# Altium schematic sheet RS232toUART.SchDoc: RS232 to UART Converter
size 431 x 279 mm; DocumentNumber: 12; SheetNumber: 12; SheetTotal: 18; ENG_APP_DATE: --/--/--; DSN_APP_DATE: --/--/--; CHK_APP_DATE: --/--/--
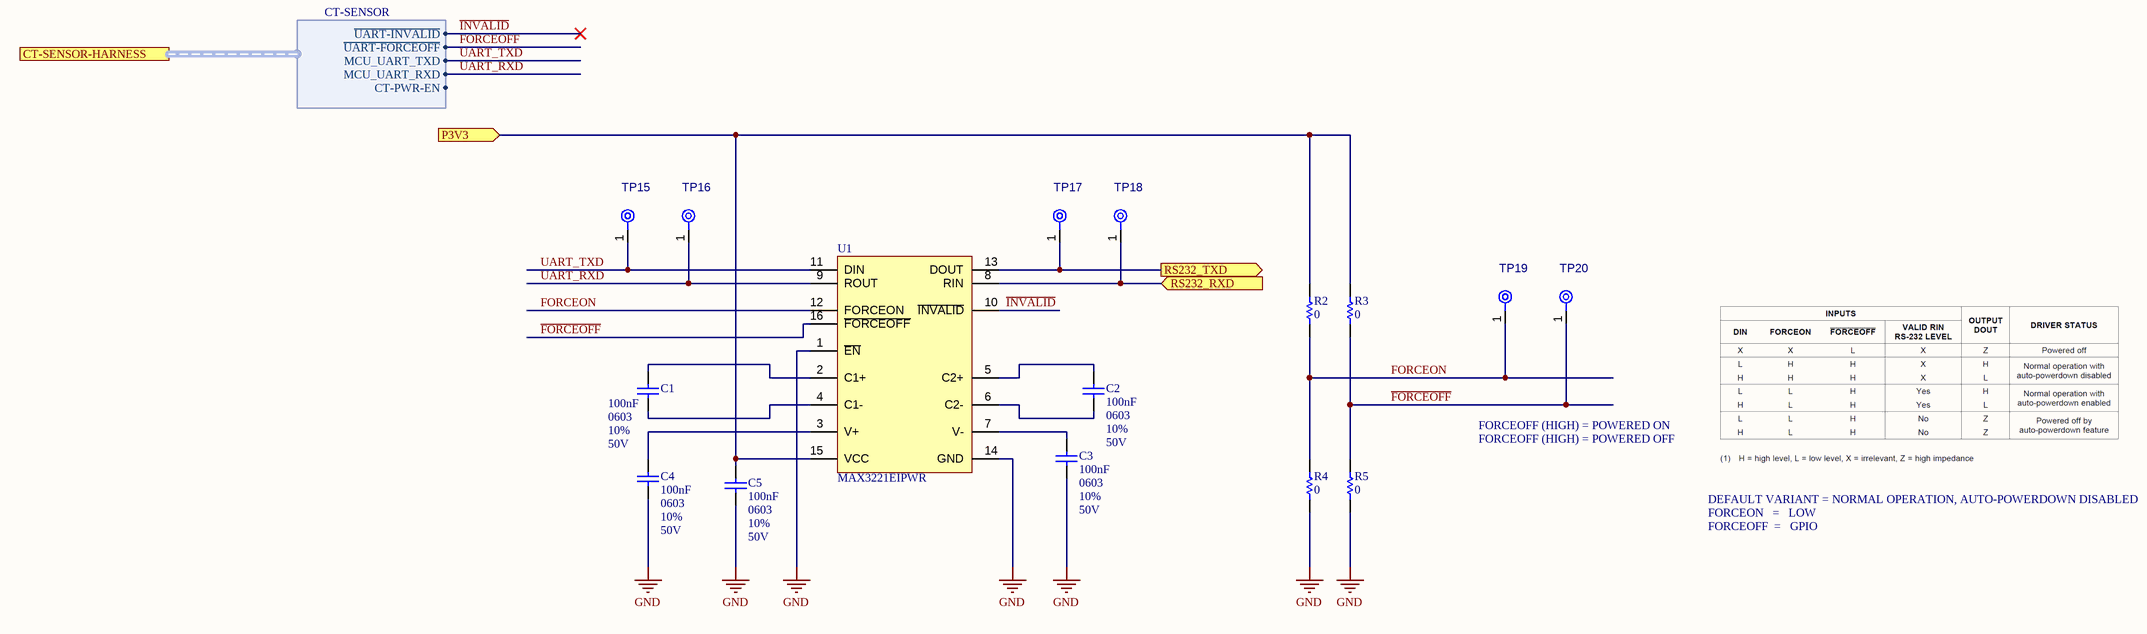
[diagram p0: RS232toUART.SchDoc]

## Parts
C1  value 100nF  Case/Package: 0603  Tolerance: 10%  Voltage Rating: 50V  [CAPC1608X90X40ML10T20]  (hidden comment: Capacitor 100nF +/- 10%, 50V, X7R, 0603)
C2  value 100nF  Case/Package: 0603  Tolerance: 10%  Voltage Rating: 50V  [CAPC1608X90X40ML10T20]  (hidden comment: Capacitor 100nF +/- 10%, 50V, X7R, 0603)
C3  value 100nF  Case/Package: 0603  Tolerance: 10%  Voltage Rating: 50V  [CAPC1608X90X40ML10T20]  (hidden comment: Capacitor 100nF +/- 10%, 50V, X7R, 0603)
C4  value 100nF  Case/Package: 0603  Tolerance: 10%  Voltage Rating: 50V  [CAPC1608X90X40ML10T20]  (hidden comment: Capacitor 100nF +/- 10%, 50V, X7R, 0603)
C5  value 100nF  Case/Package: 0603  Tolerance: 10%  Voltage Rating: 50V  [CAPC1608X90X40ML10T20]  (hidden comment: Capacitor 100nF +/- 10%, 50V, X7R, 0603)
R2  value 0  [RESC2013X50X35ML15T15]  (hidden comment: Resistor 0R +/- 1% 0805 125 mW)
R3  value 0  [RESC2013X50X35ML15T15]  (hidden comment: Resistor 0R +/- 1% 0805 125 mW)
R4  value 0  [RESC2013X50X35ML15T15]  (hidden comment: Resistor 0R +/- 1% 0805 125 mW)
R5  value 0  [RESC2013X50X35ML15T15]  (hidden comment: Resistor 0R +/- 1% 0805 125 mW)
TP15  TPAD6R-CIRCLED  [TP06R - Circled]  (value not drawn)  (no BOM)
TP16  TPAD6R-CIRCLED  [TP06R - Circled]  (value not drawn)  (no BOM)
TP17  TPAD6R-CIRCLED  [TP06R - Circled]  (value not drawn)  (no BOM)
TP18  TPAD6R-CIRCLED  [TP06R - Circled]  (value not drawn)  (no BOM)
TP19  TPAD6R-CIRCLED  [TP06R - Circled]  (value not drawn)  (no BOM)
TP20  TPAD6R-CIRCLED  [TP06R - Circled]  (value not drawn)  (no BOM)
U1  MAX3221EIPWR  [PW0016A_M]

## Ports
CT-SENSOR-HARNESS (harness CT-SENSOR), P3V3 (in), RS232_RXD (in), RS232_TXD (out)

## Harnesses
CT-SENSOR: MCU_UART_RXD, MCU_UART_TXD, ~{UART-FORCEOFF}, ~{UART-INVALID}, CT-PWR-EN

## Nets
GND: C3.1 C4.1 C5.1 R4.1 R5.1 U1.1(~{EN}) U1.14(GND)
~{FORCEOFF}: R3.1 R5.2 TP20.1(TP) U1.16(~{FORCEOFF}) ; port CT-SENSOR-HARNESS.~{UART-FORCEOFF}
~{INVALID}: U1.10(~{INVALID}) ; port CT-SENSOR-HARNESS.~{UART-INVALID}
FORCEON: R2.1 R4.2 TP19.1(TP) U1.12(FORCEON)
P3V3: C5.2 R2.2 R3.2 U1.15(VCC) ; port P3V3
RS232_RXD: TP18.1(TP) U1.8(RIN) ; port RS232_RXD
RS232_TXD: TP17.1(TP) U1.13(DOUT) ; port RS232_TXD
UART_RXD: TP16.1(TP) U1.9(ROUT) ; port CT-SENSOR-HARNESS.MCU_UART_RXD
UART_TXD: TP15.1(TP) U1.11(DIN) ; port CT-SENSOR-HARNESS.MCU_UART_TXD
NetC1_1: C1.1 U1.4(C1-)
NetC1_2: C1.2 U1.2(C1+)
NetC2_1: C2.1 U1.5(C2+)
NetC2_2: C2.2 U1.6(C2-)
NetC3_2: C3.2 U1.7(V-)
NetC4_2: C4.2 U1.3(V+)

## Notes on the sheet
- FORCEOFF (HIGH) = POWERED ON
- FORCEOFF (HIGH) = POWERED OFF
- DEFAULT VARIANT = NORMAL OPERATION, AUTO-POWERDOWN DISABLED
- FORCEON   =   LOW
- FORCEOFF  =   GPIO
- THIS DOCUMENT AND THE DATA DISCLOSED HEREIN OR HEREWITH IS THE PROPERTY OF APPLIED PHYSICS LAB - UNIVERSITY OF WASHINGTON.
- PROJECT
- TITLE
- FILE NAME
- SIZE
- B
- CAGE CODE
- DWG NO.
- SHEET
- OF
- REV

## Library data of the parts
C1-C5 = CMP-001-00206-10: Chip Capacitor, 100nF, +/- 10%, 50 V, X7R 0603 (1608 Metric); Capacitor Type: Ceramic; Dielectric: X7R; Pins: 2; RoHS Compliant: True; Max Operating Temperature: 125°C; Capacitance: 100nF; Min Operating Temperature: -55°C; Decade: 100nF; Mount: Surface Mount
R2-R5 = CMP-009-00001-8: Chip Resistor, 0 Ohm, +/- 1%, 125 mW, -55 to 155 degC, 0805 (2012 Metric); Voltage Rating: 150V; Power: 125mW; Decade: 0; RoHS Compliant: True; Min Operating Temperature: -55°C; Pins: 2; Max Operating Temperature: 155°C; Tolerance: 1%; Case/Package: 0805; Mount: Surface Mount
TP15-TP20 = CMP-00028-00014-3: 0.6mm round with a silkscreen circle.; Pins: 1
U1 = CMP-015-00021-3: IC DRVR/RCVR RS232 1CH 16-TSSOP; Min Supply Voltage: 3V; Simplex/Duplex: Full Duplex; Max Supply Voltage: 5.5V; Number of Transceivers: 1; Data Rate: 250Kbps; Min Operating Temperature: -40°C; Max Operating Temperature: 85°C; Mount: Surface Mount; Case/Package: TSSOP